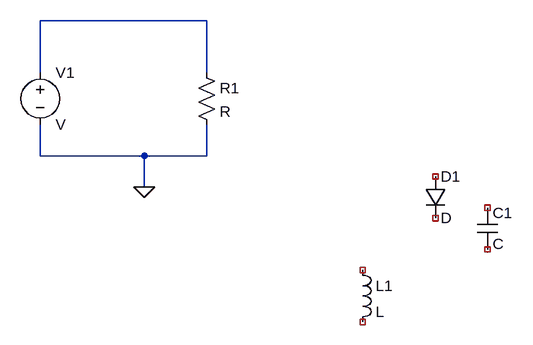
[diagram p0: schematic getting_started.asc]
getting_started.asc, the LTspice schematic file:
Version 4
SHEET 1 880 680
WIRE 160 -80 -96 -80
WIRE -96 0 -96 -80
WIRE 160 0 160 -80
WIRE -96 128 -96 80
WIRE 64 128 -96 128
WIRE 160 128 160 80
WIRE 160 128 64 128
WIRE 64 176 64 128
FLAG 64 176 0
SYMBOL res 144 -16 R0
SYMATTR InstName R1
SYMBOL cap 576 208 R0
SYMATTR InstName C1
SYMBOL diode 496 160 R0
SYMATTR InstName D1
SYMBOL ind 384 288 R0
SYMATTR InstName L1
SYMBOL voltage -96 -16 R0
SYMATTR InstName V1

The netlist it stands for:
* getting_started.asc
R1 N001 0 R
C1 NC_01 NC_02 C
D1 NC_03 NC_04 D
L1 NC_05 NC_06 L
V1 N001 0 V
.model D D
.lib standard.dio
.backanno
.end